# EAGLE schematic Z80fun_CPUtest (EAGLE 7.2.0)
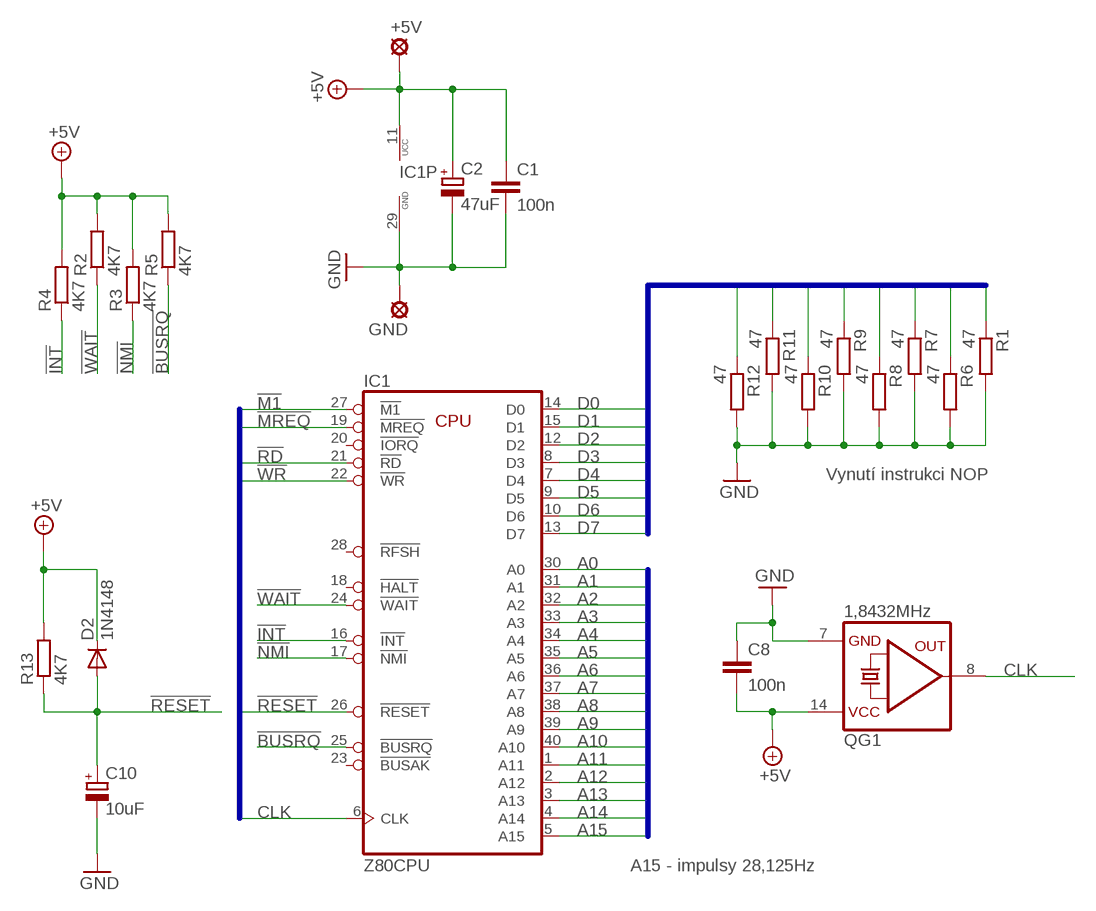
[diagram p0: schematic, sheet 1]

## Parts
+5V  LSP11  [LSP11]
C1  100n  C-EU050-024X044  [C050-024X044]
C2  47uF  CPOL-EUE2,5-6E  [E2,5-6E]
C8  100n  C-EU050-024X044  [C050-024X044]
C10  10uF  CPOL-EUE2.5-5  [E2,5-5]
D2  1N4148  1N4148DO35-7  [DO35-7]
GND  LSP11  [LSP11]
IC1  Z80CPU  [DIL40]
QG1  1,8432MHz  QG5860  [DIL14S]
R1  47  R-EU_0207/12  [0207/12]
R2  4K7  R-EU_0207/10  [0207/10]
R3  4K7  R-EU_0207/10  [0207/10]
R4  4K7  R-EU_0207/12  [0207/12]
R5  4K7  R-EU_0207/12  [0207/12]
R6  47  R-EU_0207/12  [0207/12]
R7  47  R-EU_0207/12  [0207/12]
R8  47  R-EU_0207/12  [0207/12]
R9  47  R-EU_0207/12  [0207/12]
R10  47  R-EU_0207/12  [0207/12]
R11  47  R-EU_0207/12  [0207/12]
R12  47  R-EU_0207/12  [0207/12]
R13  4K7  R-EU_0207/10  [0207/10]

## Nets
!BUSRQ: IC1.25(!BUSRQ) R5.1
!INT: IC1.16(!INT) R4.1
!M1: IC1.27(!M1)
!MREQ: IC1.19(!MREQ)
!NMI: IC1.17(!NMI) R3.1
!RD: IC1.21(!RD)
!RESET: C10.+ D2.A IC1.26(!RESET) R13.1
!WAIT: IC1.24(!WAIT) R2.1
!WR: IC1.22(!WR)
+5V: +5V.MP C1.1 C2.+ C8.2 D2.C IC1.11(UCC) QG1.14(VCC) R2.2 R3.2 R4.2 R5.2 R13.2
A0: IC1.30(A0)
A1: IC1.31(A1)
A2: IC1.32(A2)
A3: IC1.33(A3)
A4: IC1.34(A4)
A5: IC1.35(A5)
A6: IC1.36(A6)
A7: IC1.37(A7)
A8: IC1.38(A8)
A9: IC1.39(A9)
A10: IC1.40(A10)
A11: IC1.1(A11)
A12: IC1.2(A12)
A13: IC1.3(A13)
A14: IC1.4(A14)
A15: IC1.5(A15)
CLK: IC1.6(CLK) QG1.8(OUT)
D0: IC1.14(D0) R1.1
D1: IC1.15(D1) R6.1
D2: IC1.12(D2) R7.1
D3: IC1.8(D3) R8.1
D4: IC1.7(D4) R9.1
D5: IC1.9(D5) R10.1
D6: IC1.10(D6) R11.1
D7: IC1.13(D7) R12.1
GND: C1.2 C2.- C8.1 C10.- GND.MP IC1.29(GND) QG1.7(GND) R1.2 R6.2 R7.2 R8.2 R9.2 R10.2 R11.2 R12.2
Unconnected: IC1.18(!HALT) IC1.20(!IORQ) IC1.23(!BUSAK) IC1.28(!RFSH)

## Buses
A[0..15]
D[0..7]
!M1,!MREQ,!IORQ,!RD,!WR,!RESET,CLK

## Notes on the sheet
- Vynutí instrukci NOP
- A15 - impulsy 28,125Hz

## Library data of the parts
+5V GND = solpad:LSP11: SOLDER PAD drill 1.1 mm
C1 C8 = rcl:C-EU: CAPACITOR, European symbol
C2 C10 = rcl:CPOL-EU: POLARIZED CAPACITOR, European symbol
D2 = diode:1N4148: DIODE high speed (Philips)
IC1 = moje_z80:Z80CPU: Z80 CPU
QG1 = crystal:QG5860: CRYSTAL RESONATOR
R1-R13 = rcl:R-EU_: RESISTOR, European symbol